# Altium project LPC55S69.PrjPcb
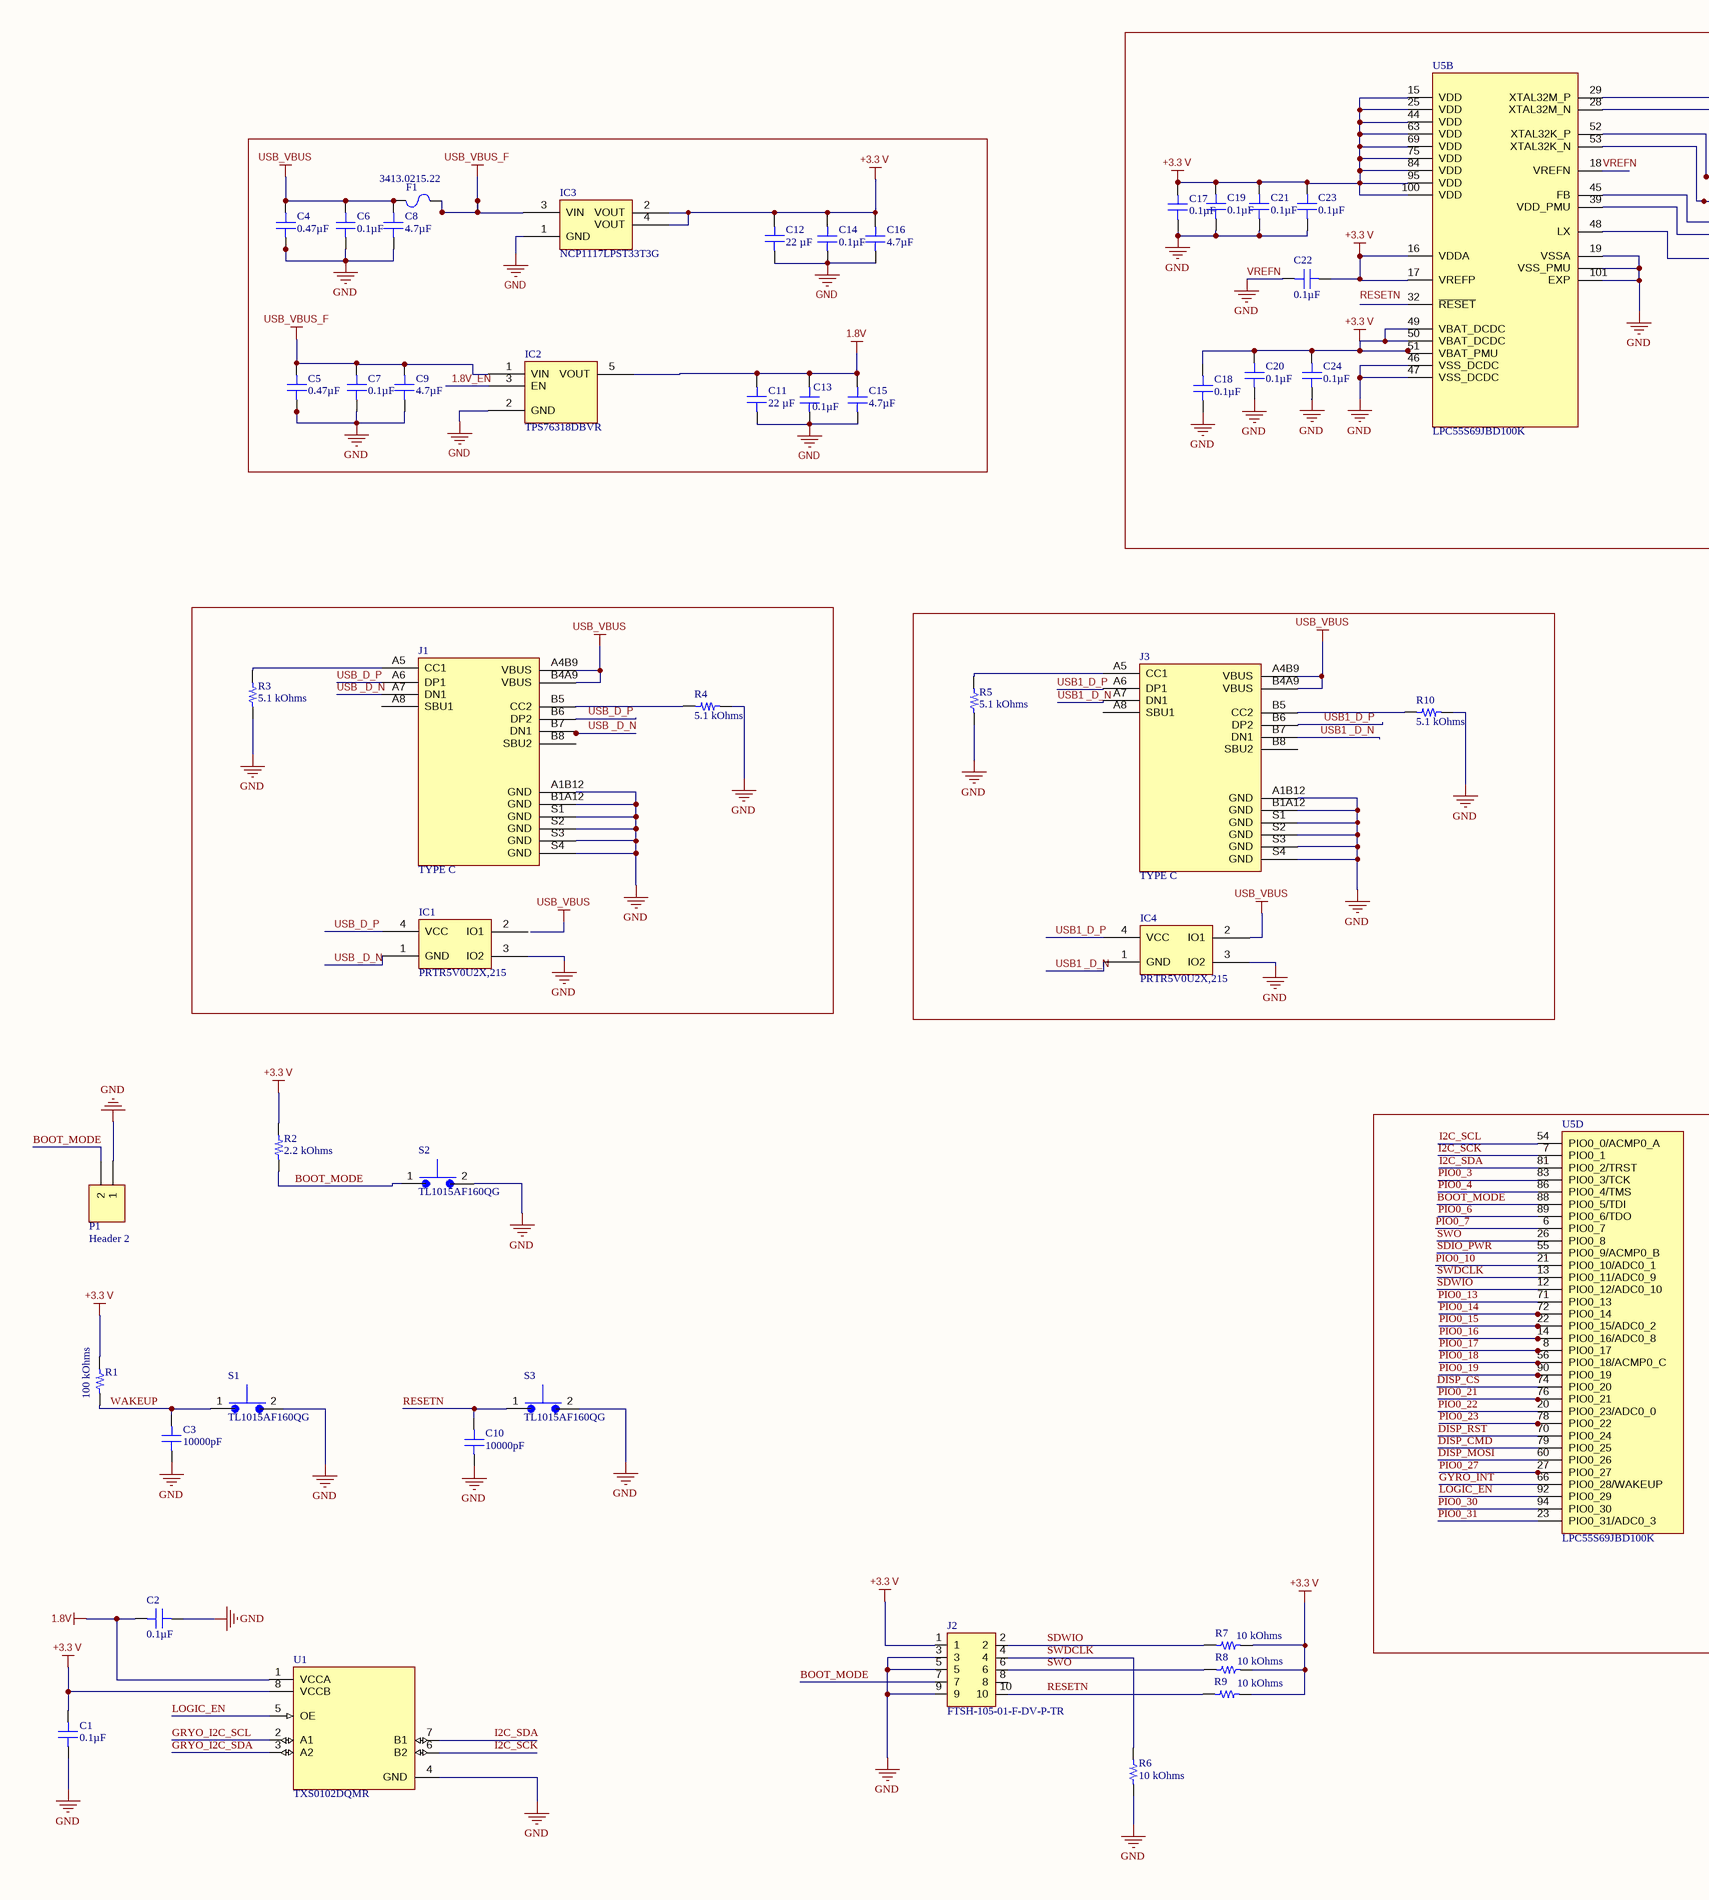
[diagram p0: Sheet1.SchDoc, left]
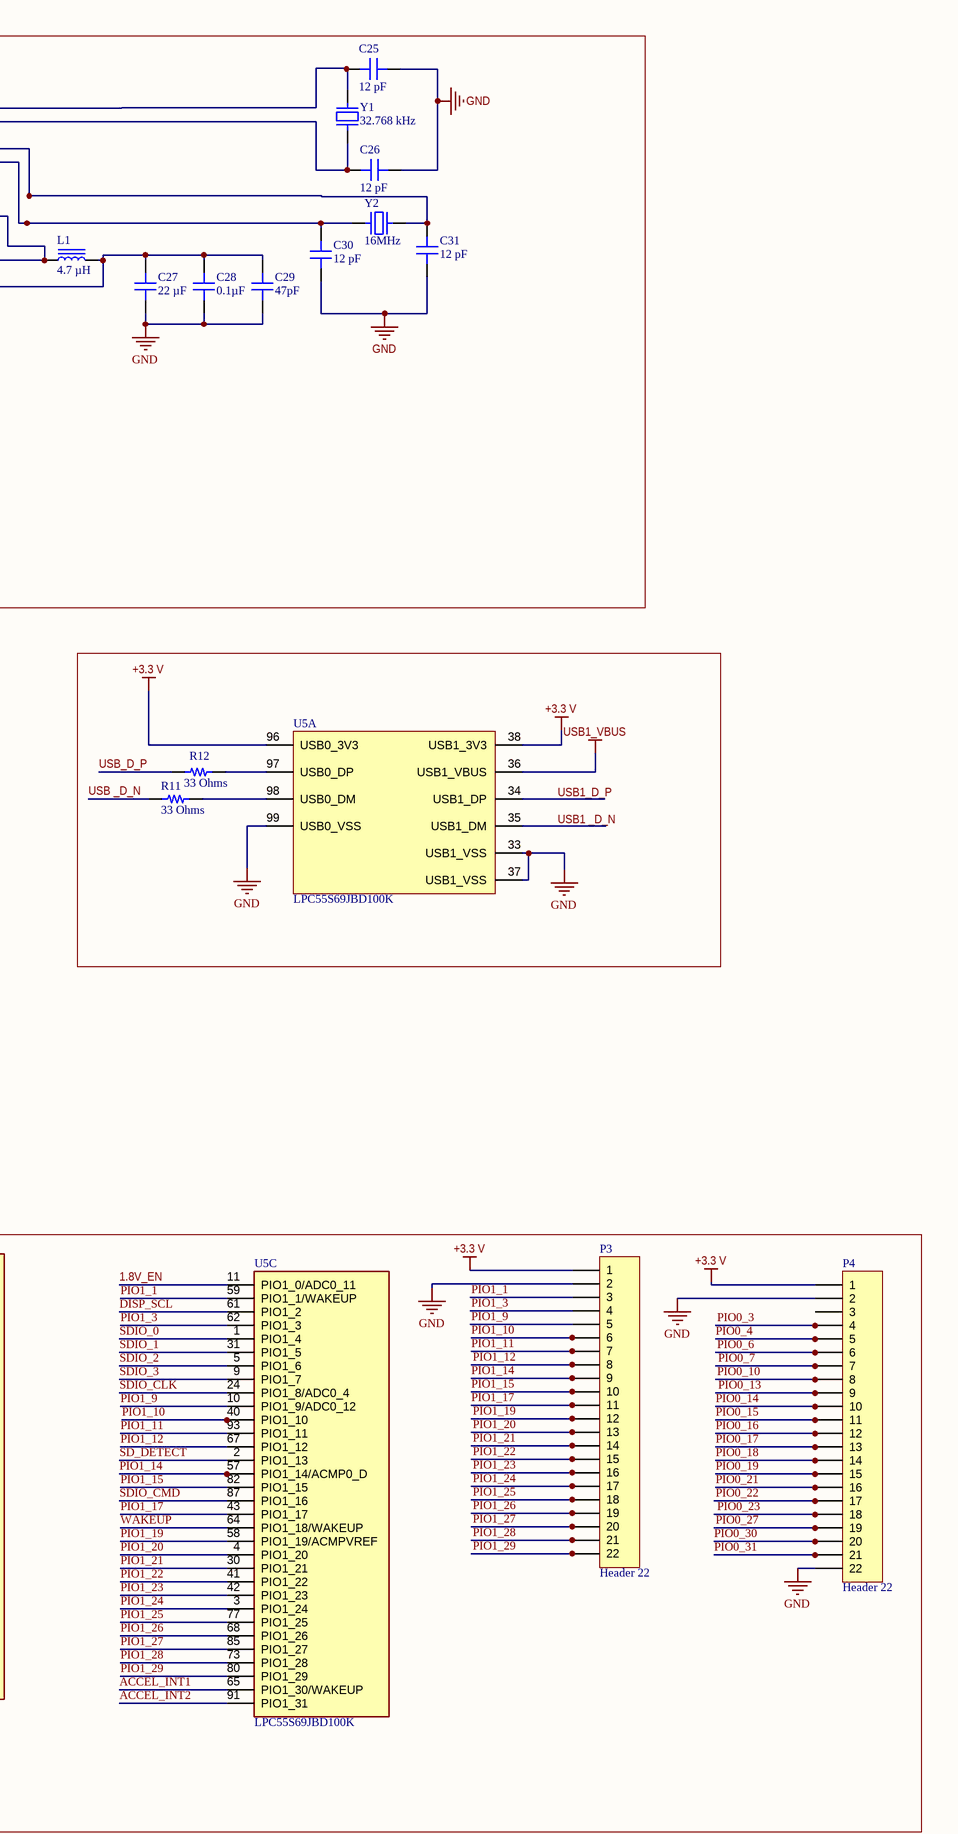
[diagram p1: Sheet1.SchDoc, right]
2 sheets, 116 parts. Net scope: global (net labels, ports and power ports of the same name join across sheets).
Board file: DEV.PcbDoc
Sheets:
  Sheet1.SchDoc
  Sheet2.SchDoc

## Sheet Sheet1.SchDoc
size 558 x 431 mm; Engineer: Mahmut Akçakoca; SheetNumber: 1; SheetTotal: 2

### Parts
C1  0.1µF  [CAP 0603_1608]
C2  0.1µF  [CAP 0603_1608]
C3  10000pF  [CAP 0603_1608]
C4  0.47µF  [CAP 0603_1608]
C5  0.47µF  [CAP 0603_1608]
C6  0.1µF  [CAP 0603_1608]
C7  0.1µF  [CAP 0603_1608]
C8  4.7µF  [CAP 0603_1608]
C9  4.7µF  [CAP 0603_1608]
C10  10000pF  [CAP 0603_1608]
C11  22 µF  [CAP 0603_1608]
C12  22 µF  [CAP 0603_1608]
C13  0.1µF  [CAP 0603_1608]
C14  0.1µF  [CAP 0603_1608]
C15  4.7µF  [CAP 0603_1608]
C16  4.7µF  [CAP 0603_1608]
C17  0.1µF  [CAP 0603_1608]
C18  0.1µF  [CAP 0603_1608]
C19  0.1µF  [CAP 0603_1608]
C20  0.1µF  [CAP 0603_1608]
C21  0.1µF  [CAP 0603_1608]
C22  0.1µF  [CAP 0603_1608]
C23  0.1µF  [CAP 0603_1608]
C24  0.1µF  [CAP 0603_1608]
C25  12 pF  [CAP 0603_1608]
C26  12 pF  [CAP 0603_1608]
C27  22 µF  [CAP 0603_1608]
C28  0.1µF  [CAP 0603_1608]
C29  47pF  [CAP 0603_1608]
C30  12 pF  [CAP 0603_1608]
C31  12 pF  [CAP 0603_1608]
F1  3413.0215.22  [FUSE 1206_3216 0.6MM]
IC1  PRTR5V0U2X,215  [SOT143B]
IC2  TPS76318DBVR  [TI SOT-23-5 DBV]
IC3  NCP1117LPST33T3G  [ON SEMI SOT-223 ST(318H)]
IC4  PRTR5V0U2X,215  [SOT143B]
J1  TYPE C  [HRO_TYPE-C-31-M-12]
J2  FTSH-105-01-F-DV-P-TR  [SAMTEC_FTSH-105-01-F-DV-P-TR]
J3  TYPE C  [HRO_TYPE-C-31-M-12]
L1  4.7 µH  [TDK VLS252012CX]
P1  Header 2  [HDR1X2]
P3  Header 22  [HDR1X22]
P4  Header 22  [HDR1X22]
R1  100 kOhms  [RES 0603_1608]
R2  2.2 kOhms  [RES 0603_1608]
R3  5.1 kOhms  [RES 0603_1608]
R4  5.1 kOhms  [RES 0603_1608]
R5  5.1 kOhms  [RES 0603_1608]
R6  10 kOhms  [RES 0603_1608]
R7  10 kOhms  [RES 0603_1608]
R8  10 kOhms  [RES 0603_1608]
R9  10 kOhms  [RES 0603_1608]
R10  5.1 kOhms  [RES 0603_1608]
R11  33 Ohms  [RES 0603_1608]
R12  33 Ohms  [RES 0603_1608]
S1  TL1015AF160QG  [SW_TL1015AF160QG]
S2  TL1015AF160QG  [SW_TL1015AF160QG]
S3  TL1015AF160QG  [SW_TL1015AF160QG]
U1  TXS0102DQMR  [IC_TXS0102DQMR]
U5  LPC55S69JBD100K  [QFP50P1600X1600X160-101N]  (parts A,B,C,D of 4)
Y1  32.768 kHz  [ABRACON ABS06]
Y2  16MHz  [KYOCERA CX3225GB]

### Nets
1.8V: C2.2 C11.1 C13.2 C15.2 IC2.5(VOUT) U1.1(VCCA)
+3.3 V: C1.2 C12.1 C14.2 C16.2 C17.1 C18.2 C19.1 C20.2 C21.1 C22.2 C23.1 C24.2 IC3.2(VOUT) IC3.4(VOUT) J2.1 P3.1 P4.1 R1.2 R2.2 R7.2 R8.2 R9.2 U1.8(VCCB) U5.15(VDD) U5.16(VDDA) U5.17(VREFP) U5.25(VDD) U5.38(USB1_3V3) U5.44(VDD) U5.49(VBAT_DCDC) U5.50(VBAT_DCDC) U5.51(VBAT_PMU) U5.63(VDD) U5.69(VDD) U5.75(VDD) U5.84(VDD) U5.95(VDD) U5.96(USB0_3V3) U5.100(VDD)  [project net VDD]
GND: C1.1 C2.1 C3.1 C4.1 C5.1 C6.1 C7.1 C8.1 C9.1 C10.1 C11.2 C12.2 C13.1 C14.1 C15.1 C16.1 C17.2 C18.1 C19.2 C20.1 C21.2 C22.1 C23.2 C24.1 C25.2 C26.2 C27.2 C28.1 C29.1 C30.2 C31.2 IC1.3(IO2) IC2.2(GND) IC3.1(GND) IC4.3(IO2) J1.A1B12(GND) J1.B1A12(GND) J1.S1(GND) J1.S2(GND) J1.S3(GND) J1.S4(GND) J2.3 J2.5 J2.9 J3.A1B12(GND) J3.B1A12(GND) J3.S1(GND) J3.S2(GND) J3.S3(GND) J3.S4(GND) P1.1 P3.2 P4.2 P4.22 R3.1 R4.2 R5.1 R6.1 R10.2 S1.2 S2.2 S3.2 U1.4(GND) U5.18(VREFN) U5.19(VSSA) U5.33(USB1_VSS) U5.37(USB1_VSS) U5.46(VSS_DCDC) U5.47(VSS_DCDC) U5.99(USB0_VSS) U5.101(EXP) U5.?1(VSS_PMU)  [also labelled VREFN]
USB1_VBUS: U5.36(USB1_VBUS)
USB_VBUS: C4.2 C6.2 C8.2 F1.1 IC4.2(IO1) J1.A4B9(VBUS) J1.B4A9(VBUS) J3.A4B9(VBUS) J3.B4A9(VBUS)
USB_VBUS_F: C5.2 C7.2 C9.2 F1.2 IC2.1(VIN) IC3.3(VIN)
1.8V_EN: IC2.3(EN) U5.11(PIO1_0/ADC0_11)
ACCEL_INT1: U5.65(PIO1_30/WAKEUP)
ACCEL_INT2: U5.91(PIO1_31)
BOOT_MODE: J2.7 P1.2 R2.1 S2.1 U5.88(PIO0_5/TDI)
DISP_CMD: U5.79(PIO0_25)
DISP_CS: U5.74(PIO0_20)
DISP_MOSI: U5.60(PIO0_26)
DISP_RST: U5.70(PIO0_24)
DISP_SCL: U5.61(PIO1_2)
GRYO_I2C_SCL: U1.2(A1)
GRYO_I2C_SDA: U1.3(A2)
GYRO_INT: U5.66(PIO0_28/WAKEUP)
I2C_SCK: U1.6(B2) U5.7(PIO0_1)
I2C_SCL: U5.54(PIO0_0/ACMP0_A)
I2C_SDA: U1.7(B1) U5.81(PIO0_2/TRST)
LOGIC_EN: U1.5(OE) U5.92(PIO0_29)
PIO0_3: P4.4 U5.83(PIO0_3/TCK)
PIO0_4: P4.5 U5.86(PIO0_4/TMS)
PIO0_6: P4.6 U5.89(PIO0_6/TDO)
PIO0_7: P4.7 U5.6(PIO0_7)
PIO0_10: P4.8 U5.21(PIO0_10/ADC0_1)
PIO0_13: P4.9 U5.71(PIO0_13)
PIO0_14: P4.10 U5.72(PIO0_14)
PIO0_15: P4.11 U5.22(PIO0_15/ADC0_2)
PIO0_16: P4.12 U5.14(PIO0_16/ADC0_8)
PIO0_17: P4.13 U5.8(PIO0_17)
PIO0_18: P4.14 U5.56(PIO0_18/ACMP0_C)
PIO0_19: P4.15 U5.90(PIO0_19)
PIO0_21: P4.16 U5.76(PIO0_21)
PIO0_22: P4.17 U5.20(PIO0_23/ADC0_0)
PIO0_23: P4.18 U5.78(PIO0_22)
PIO0_27: P4.19 U5.27(PIO0_27)
PIO0_30: P4.20 U5.94(PIO0_30)
PIO0_31: P4.21 U5.23(PIO0_31/ADC0_3)
PIO1_1: P3.3 U5.59(PIO1_1/WAKEUP)
PIO1_3: P3.4 U5.62(PIO1_3)
PIO1_9: P3.5 U5.10(PIO1_9/ADC0_12)
PIO1_10: P3.6 U5.40(PIO1_10)
PIO1_11: P3.7 U5.93(PIO1_11)
PIO1_12: P3.8 U5.67(PIO1_12)
PIO1_14: P3.9 U5.57(PIO1_14/ACMP0_D)
PIO1_15: P3.10 U5.82(PIO1_15)
PIO1_17: P3.11 U5.43(PIO1_17)
PIO1_19: P3.12 U5.58(PIO1_19/ACMPVREF)
PIO1_20: P3.13 U5.4(PIO1_20)
PIO1_21: P3.14 U5.30(PIO1_21)
PIO1_22: P3.15 U5.41(PIO1_22)
PIO1_23: P3.16 U5.42(PIO1_23)
PIO1_24: P3.17 U5.3(PIO1_24)
PIO1_25: P3.18 U5.77(PIO1_25)
PIO1_26: P3.19 U5.68(PIO1_26)
PIO1_27: P3.20 U5.85(PIO1_27)
PIO1_28: P3.21 U5.73(PIO1_28)
PIO1_29: P3.22 U5.80(PIO1_29)
RESETN: C10.2 J2.10 R9.1 S3.1
SD_DETECT: U5.2(PIO1_13)
SDIO_0: U5.1(PIO1_4)
SDIO_1: U5.31(PIO1_5)
SDIO_2: U5.5(PIO1_6)
SDIO_3: U5.9(PIO1_7)
SDIO_CLK: U5.24(PIO1_8/ADC0_4)
SDIO_CMD: U5.87(PIO1_16)
SDIO_PWR: U5.55(PIO0_9/ACMP0_B)
SDWIO: J2.2 R7.1 U5.12(PIO0_12/ADC0_10)
SWDCLK: J2.4 R6.2 U5.13(PIO0_11/ADC0_9)
SWO: J2.6 R8.1 U5.26(PIO0_8)
USB1 _D_N: IC4.1(GND) J3.A7(DN1) J3.B7(DN1)
USB1_D_P: IC4.4(VCC) J3.A6(DP1) J3.B6(DP2)
USB _D_N: IC1.1(GND) J1.A7(DN1) J1.B7(DN1) R11.1
USB_D_P: IC1.4(VCC) J1.A6(DP1) J1.B6(DP2) R12.1
WAKEUP: C3.2 R1.1 S1.1 U5.64(PIO1_18/WAKEUP)
NetC25_1: C25.1 U5.29(XTAL32M_P) Y1.2
NetC26_1: C26.1 U5.28(XTAL32M_N) Y1.1
NetC27_1: C27.1 C28.2 C29.2 L1.2 U5.48(LX)
NetC30_1: C30.1 U5.53(XTAL32K_N) Y2.1
NetC31_1: C31.1 U5.52(XTAL32K_P) Y2.3
NetJ1_A5: J1.A5(CC1) R3.2
NetJ1_B5: J1.B5(CC2) R4.1
NetJ3_A5: J3.A5(CC1) R5.2
NetJ3_B5: J3.B5(CC2) R10.1
NetL1_1: L1.1 U5.39(VDD_PMU) U5.45(FB)
NetR11_2: R11.2 U5.98(USB0_DM)
NetR12_2: R12.2 U5.97(USB0_DP)

Not connected (* = marked no-connect by the designer): IC1 2(IO1); J1 A8(SBU1) B8(SBU2); J2 8; J3 A8(SBU1) B8(SBU2); P4 3; U5 32(~{RESET}) 34(USB1_DP) 35(USB1_DM)

### Notes on the sheet
- Labels drawn without touching a wire or pin: RESETN, USB1 _D_N, USB1_D_P
- DWG. NO.
- REV.
- SHT.
- REVISION
- DESCRIPTION
- DATE
- APPROVED
- THIS DOCUMENT AND THE DATA DISCLOSED HEREIN OR HEREWITH IS THE PROPERTY OF ALTIUM LIMITED AND MAY BE FREELY DISTRIBUTED IN WHOLE. NO RIGHTS ARE RESERVED OR EXPRESS OR IMPLIED WARANTEE GIVEN.
- ENG:
- DSN:
- APPROVALS
- PROJECT
- DOCUMENT REVISION:
- DESIGN ITEM:
- CHK:
- BOM:
- REFERENCE DOCUMENTS
- PROJECT REVISION:
- TITLE
- FAB DWG:
- PCB DWG:
- ASSY DWG:
- SCALE:
- SIZE
- C
- CAGE CODE
- FILE NAME
- DWG NO.
- SHEET
- OF
- REV

### Library data of the parts
C1 C2 C6 C7 C13 C14 C17-C24 C28 = 0603YD104KAT2A: CAP CER 0.1UF 16V X5R 0603; manufacturer: AVX Corporation; Tolerance: ±10%; Part Number: 0603YD104KAT2A; Value: 0.1µF; Applications: General Purpose; Capacitance: 0.1µF; componentlink1description: Datasheet; componentlink1url: http://datasheets.avx.com/cx5r.pdf; componentlink2description: DigiKey Link; componentlink2url: http://digikey.com/product-detail/en/avx-corporation/0603YD104KAT2A/478-0603YD104KAT2ACT-ND/11570385; Device Package: 0603 (1608 Metric); lastupdated: 2.09.2020 01:02:55; Lifecycle Status: Active; Minimum Order: 1; Mounting Type: Surface Mount, MLCC; Operating Temperature: -55°C ~ 85°C; Package / Case: 0603 (1608 Metric); packaging: TapeAndReel; partid: 27394; Part Status: Active; price: 0.05; series: -; Supplier 1: DigiKey; Supplier Part Number 1: 478-0603YD104KAT2ACT-ND; Temperature Coefficient: X5R; Voltage - Rated: 16V
C3 C10 = 06033D103KAT2A: CAP CER 10000PF 25V X5R 0603; Part Number: 06033D103KAT2A
C4 C5 = 0603ZD474KAT2A: CAP CER 0.47UF 10V X5R 0603; manufacturer: AVX Corporation; Tolerance: ±10%; Part Number: 0603ZD474KAT2A; Value: 0.47µF; Applications: General Purpose; Capacitance: 0.47µF; componentlink1description: Datasheet; componentlink1url: http://datasheets.avx.com/cx5r.pdf; componentlink2description: DigiKey Link; componentlink2url: http://digikey.com/product-detail/en/avx-corporation/0603ZD474KAT2A/478-7942-1-ND/3881565; Device Package: 0603 (1608 Metric); lastupdated: 2.09.2020 01:03:34; Lifecycle Status: Active; Minimum Order: 1; Mounting Type: Surface Mount, MLCC; Operating Temperature: -55°C ~ 85°C; Package / Case: 0603 (1608 Metric); packaging: TapeAndReel; partid: 3385; Part Status: Active; price: 0.10; series: -; Size / Dimension: 0.063" L x 0.032" W (1.60mm x 0.81mm); Supplier 1: DigiKey; Supplier Part Number 1: 478-7942-1-ND; Temperature Coefficient: X5R; Thickness (Max): 0.035" (0.90mm); Voltage - Rated: 10V
C8 C9 C15 C16 = 0603ZD475KAT2A: CAP CER 4.7UF 10V X5R 0603; manufacturer: AVX Corporation; Tolerance: ±10%; Part Number: 0603ZD475KAT2A; Value: 4.7µF; Applications: General Purpose; Capacitance: 4.7µF; componentlink1description: Datasheet; componentlink1url: http://datasheets.avx.com/cx5r.pdf; componentlink2description: DigiKey Link; componentlink2url: http://digikey.com/product-detail/en/avx-corporation/0603ZD475KAT2A/478-7943-1-ND/3881566; Device Package: 0603 (1608 Metric); lastupdated: 2.09.2020 01:02:59; Lifecycle Status: Active; Minimum Order: 1; Mounting Type: Surface Mount, MLCC; Operating Temperature: -55°C ~ 85°C; Package / Case: 0603 (1608 Metric); partid: 18469; Part Status: Active; price: 0; series: -; Size / Dimension: 0.063" L x 0.032" W (1.60mm x 0.81mm); Supplier 1: DigiKey; Supplier Part Number 1: 478-7943-1-ND; Temperature Coefficient: X5R; Thickness (Max): 0.035" (0.90mm); Voltage - Rated: 10V
C11 C12 C27 = CL10A226MQ8NRNC: CAP CER 22UF 6.3V X5R 0603; manufacturer: Samsung Electro-Mechanics; Tolerance: ±20%; Part Number: CL10A226MQ8NRNC; Value: 22 µF; Applications: General Purpose; Capacitance: 22 µF; componentlink1description: Datasheet; componentlink1url: http://www.samsungsem.com/kr/support/product-search/mlcc/CL10A226MQ8NRNC.jsp; componentlink2description: DigiKey Link; componentlink2url: https://www.digikey.com/en/products/detail/samsung-electro-mechanics/CL10A226MQ8NRNC/3886851; Device Package: 0603 (1608 Metric); lastupdated: 14.08.2022 21:09:18; Lifecycle Status: Active; Minimum Order: 1; Mounting Type: Surface Mount, MLCC; Operating Temperature: -55°C ~ 85°C; Package / Case: 0603 (1608 Metric); packaging: TapeAndReel; partid: 12892; Part Status: Active; price: 0.03; series: CL; Size / Dimension: 0.063" L x 0.031" W (1.60mm x 0.80mm); Supplier 1: DigiKey; Supplier Part Number 1: 1276-1193-1-ND; Temperature Coefficient: X5R; Thickness (Max): 0.039" (1.00mm); Voltage - Rated: 6.3V
C25 C26 C30 C31 = C0603C120J3GACAUTO: CAP CER 12PF 25V C0G/NP0 0603; manufacturer: KEMET; Temperature Coefficient: C0G, NP0; Tolerance: ±5%; Part Number: C0603C120J3GACAUTO; Value: 12 pF; Applications: Automotive; Capacitance: 12 pF; componentlink1description: Datasheet; componentlink1url: https://api.kemet.com/component-edge/download/datasheet/C0603C120J3GACAUTO.pdf; componentlink2description: DigiKey Link; componentlink2url: https://www.digikey.com/en/products/detail/kemet/C0603C120J3GACAUTO/11675595; Device Package: 0603 (1608 Metric); Features: Low ESL; lastupdated: 14.08.2022 21:08:38; Lifecycle Status: Active; Minimum Order: 1; Mounting Type: Surface Mount, MLCC; Operating Temperature: -55°C ~ 125°C; Package / Case: 0603 (1608 Metric); packaging: TapeAndReel; partid: 35212; Part Status: Active; price: 0.04; Ratings: AEC-Q200; series: SMD Auto C0G; Size / Dimension: 0.063" L x 0.031" W (1.60mm x 0.80mm); Supplier 1: DigiKey; Supplier Part Number 1: 399-C0603C120J3GACAUTOCT-ND; Thickness (Max): 0.034" (0.87mm); Voltage - Rated: 25V
C29 = 06033A470KAT2A: CAP CER 47PF 25V C0G/NP0 0603; manufacturer: AVX Corporation; Temperature Coefficient: C0G, NP0; Tolerance: ±10%; Part Number: 06033A470KAT2A; Value: 47pF; Applications: General Purpose; Capacitance: 47pF; componentlink1description: Datasheet; componentlink1url: http://datasheets.avx.com/C0GNP0-Dielectric.pdf; componentlink2description: DigiKey Link; componentlink2url: http://digikey.com/product-detail/en/avx-corporation/06033A470KAT2A/478-06033A470KAT2ACT-ND/11570258; Device Package: 0603 (1608 Metric); lastupdated: 2.09.2020 01:02:55; Lifecycle Status: Active; Minimum Order: 1; Mounting Type: Surface Mount, MLCC; Operating Temperature: -55°C ~ 125°C; Package / Case: 0603 (1608 Metric); packaging: TapeAndReel; partid: 27418; Part Status: Active; price: 0.04; series: -; Supplier 1: DigiKey; Supplier Part Number 1: 478-06033A470KAT2ACT-ND; Voltage - Rated: 25V
F1 = 3413.0215.22: FUSE BOARD MNT 800MA 32VAC 63VDC; Manufacturer: Schurter Inc.; Approval Agency: cURus, VDE; Breaking Capacity @ Rated Voltage: 63A; Fuse Type: Board Mount (Cartridge Style Excluded); Melting I²t: 0.18; Response Time: Fast Blow; Voltage Rating - AC: 32V; Voltage Rating - DC: 63V; Part Number: 3413.0215.22; Approvals: cURus, VDE; ComponentLink1Description: Datasheet; ComponentLink1URL: https://us.schurter.com/pdf/english/typ_USI_1206.pdf; ComponentLink2Description: DigiKey Link; ComponentLink2URL: http://digikey.com/product-detail/en/schurter-inc/3413.0215.22/486-1143-1-ND/1522975; Current Rating (Amps): 800mA; Device Package: 1206 (3216 Metric); LastUpdated: 2.09.2020 01:30:41; Lifecycle Status: Active; Minimum Order: 1; Mounting Type: Surface Mount; Operating Temperature: -55°C ~ 90°C; Package / Case: 1206 (3216 Metric); Packaging: TapeAndReel; Part Status: Active; Price: 0.26; Series: USI 1206; Size / Dimension: 0.126" L x 0.063" W x 0.024" H (3.20mm x 1.60mm x 0.60mm); Supplier 1: DigiKey; Supplier Part Number 1: 486-1143-1-ND
IC1 IC4 = PRTR5V0U2X,215: TVS DIODE 5.5V SOT143B; Manufacturer: Nexperia USA Inc.; Capacitance @ Frequency: 1pF @ 1MHz; Power Line Protection: Yes; Unidirectional Channels: 2; Voltage - Breakdown (Min): 6V; Voltage - Reverse Standoff (Typ): 5.5V (Max); Part Number: PRTR5V0U2X,215; Applications: General Purpose; ComponentLink1Description: Datasheet; ComponentLink1URL: https://assets.nexperia.com/documents/data-sheet/PRTR5V0U2X.pdf; ComponentLink2Description: DigiKey Link; ComponentLink2URL: //digikey.com/product-detail/en/nexperia-usa-inc/PRTR5V0U2X215/1727-3884-2-ND/1163690; Device Package: TO-253-4, TO-253AA; LastUpdated: 9.12.2019 21:29:05; Lifecycle Status: 0; Minimum Order: 1; Mounting Type: Surface Mount; Operating Temperature: -40°C ~ 85°C (TA); Package / Case: TO-253-4, TO-253AA; Packaging: TapeAndReel; PartId: 5451; Part Status: Active; Price: 0.18; Series: -; Supplier 1: DigiKey; Supplier Part Number 1: 1727-3884-2-ND; Supplier Device Package: SOT-143B; Type: Steering (Rail to Rail)
IC2 = TPS76318DBVR: IC REG LINEAR 1.8V 150MA SOT23-5; Manufacturer: Texas Instruments; Control Features: Enable; Current - Quiescent (Iq): 100 µA; Current - Supply (Max): 140 µA; Number of Regulators: 1; Output Configuration: Positive; Output Type: Fixed; Protection Features: Over Current, Over Temperature, Reverse Polarity; PSRR: 60dB (1kHz); Voltage - Input (Max): 10V; Part Number: TPS76318DBVR; ComponentLink1Description: Datasheet; ComponentLink1URL: http://www.ti.com/general/docs/suppproductinfo.tsp?distId=10&gotoUrl=http%3A%2F%2Fwww.ti.com%2Flit%2Fgpn%2Ftps763; ComponentLink2Description: DigiKey Link; ComponentLink2URL: https://www.digikey.com/en/products/detail/texas-instruments/TPS76318DBVR/382161; Current - Output: 150mA; LastUpdated: 14.08.2022 22:05:47; Lifecycle Status: Active; Minimum Order: 1; Mounting Type: Surface Mount; Operating Temperature: -40°C ~ 125°C; Package / Case: SC-74A, SOT-753; Packaging: TapeAndReel; Part Status: Active; Price: 0.36; Series: -; Supplier 1: DigiKey; Supplier Part Number 1: 296-11016-1-ND; Supplier Device Package: SOT-23-5; Voltage - Output (Min/Fixed): 1.8V
IC3 = NCP1117LPST33T3G: IC REG LINEAR 3.3V 1A SOT223; Manufacturer: ON Semiconductor; Current - Quiescent (Iq): 700µA; Number of Regulators: 1; Output Configuration: Positive; Output Type: Fixed; Protection Features: Over Current, Over Temperature; PSRR: 60dB (120Hz); Voltage Dropout (Max): 1.4V @ 1A; Voltage - Input (Max): 18V; Part Number: NCP1117LPST33T3G; ComponentLink1Description: Datasheet; ComponentLink1URL: http://www.onsemi.com/pub/Collateral/NCP1117LP-D.PDF; ComponentLink2Description: DigiKey Link; ComponentLink2URL: http://digikey.com/product-detail/en/on-semiconductor/NCP1117LPST33T3G/NCP1117LPST33T3GOSCT-ND/3462387; Current - Output: 1A; LastUpdated: 14.08.2022 22:05:49; Lifecycle Status: Active; Minimum Order: 1; Mounting Type: Surface Mount; Package / Case: TO-261-4, TO-261AA; Packaging: TapeAndReel; Part Status: Active; Price: 0.12; Series: -; Supplier 1: DigiKey; Supplier Part Number 1: NCP1117LPST33T3GOSCT-ND; Supplier Device Package: SOT-223; Voltage - Output (Min/Fixed): 3.3V
J1 J3 = TYPE C: HIRO TYPE-C-31-M-12
J2 = FTSH-105-01-F-DV-P-TR: Connector Header Surface Mount 10 position 0.050 (1.27mm); MF: Samtec; Value: *; SnapEDA_Link: https://www.snapeda.com/parts/FTSH-105-01-F-DV-P-TR/Samtec%20Inc./view-part/2790357/?ref=snap; MP: FTSH-105-01-F-DV-P-TR; Purchase-URL: https://pricing.snapeda.com/search/part/FTSH-105-01-F-DV-P-TR/?ref=eda; Check_prices: https://www.snapeda.com/parts/FTSH-105-01-F-DV-P-TR/Samtec%20Inc./view-part/2790357/?ref=eda; Availability: Bad; Price: None; Package: None
L1 = VLS252012CX-4R7M-1: FIXED IND 4.7UH 1.24A 210MOHM SM; Manufacturer: TDK Corporation; Current - Saturation: 1.1A; DC Resistance (DCR): 210mOhm Max; Inductance Frequency - Test: 1 MHz; Material - Core: Ferrite; Shielding: Shielded; Tolerance: ±20%; Type: Drum Core, Wirewound; Part Number: VLS252012CX-4R7M-1; ComponentLink1Description: Datasheet; ComponentLink1URL: https://product.tdk.com/info/en/catalog/datasheets/inductor_commercial_power_vls252012cx-1_en.pdf?ref_disty=digikey; ComponentLink2Description: DigiKey Link; ComponentLink2URL: https://www.digikey.com/en/products/detail/tdk-corporation/VLS252012CX-4R7M-1/5169790; Current Rating (Amps): 1.24 A; Device Package: Nonstandard; Height - Seated (Max): 0.047" (1.20mm); Inductance: 4.7 µH; LastUpdated: 14.08.2022 21:59:15; Lifecycle Status: Active; Minimum Order: 1; Mounting Type: Surface Mount; Operating Temperature: -40°C ~ 105°C; Package / Case: Nonstandard; Packaging: TapeAndReel; PartId: 228; Part Status: Active; Price: 0.15; Series: VLS-CX-1; Size / Dimension: 0.098" L x 0.079" W (2.50mm x 2.00mm); Supplier 1: DigiKey; Supplier Part Number 1: 445-172985-1-ND; Supplier Device Package: 2520; Value: 4.7 µH
P1 = Header 2: Header, 2-Pin; LatestRevisionDate: 17-Jul-2002; LatestRevisionNote: Re-released for DXP Platform.; Publisher: Altium Limited
P3 P4 = Header 22: Header, 22-Pin; LatestRevisionDate: 17-Jul-2002; LatestRevisionNote: Re-released for DXP Platform.; Publisher: Altium Limited
R1 = CRCW0603100KJNEA: RES SMD 100K OHM 5% 1/10W 0603; Manufacturer: Vishay Dale; Power (Watts): 0.1W, 1/10W; Temperature Coefficient: ±200ppm/°C; Part Number: CRCW0603100KJNEA; Value: 100 kOhms; ComponentLink1Description: Datasheet; ComponentLink1URL: http://www.vishay.com/docs/20035/dcrcwe3.pdf; ComponentLink2Description: DigiKey Link; ComponentLink2URL: https://www.digikey.com/en/products/detail/vishay-dale/CRCW0603100KJNEA/1174277; Composition: Thick Film; Device Package: 0603 (1608 Metric); Features: Automotive AEC-Q200; Height - Seated (Max): 0.020" (0.50mm); LastUpdated: 14.08.2022 21:30:46; Lifecycle Status: Active; Minimum Order: 1; Number of Terminations: 2; Operating Temperature: -55°C ~ 155°C; Package / Case: 0603 (1608 Metric); Packaging: CutTape; PartId: 21189; Part Status: Active; Price: 0.01; Ratings: AEC-Q200; Resistance: 100 kOhms; Series: CRCW; Size / Dimension: 0.063" L x 0.033" W (1.60mm x 0.85mm); Supplier 1: DigiKey; Supplier Part Number 1: 541-100KGCT-ND; Supplier Device Package: 0603; Tolerance: ±5%
R2 = CRCW06032K20JNEA: RES SMD 2.2K OHM 5% 1/10W 0603; Part Number: CRCW06032K20JNEA
R3-R5 R10 = RMCF0603JG5K10: RES 5.1K OHM 5% 1/10W 0603; Manufacturer: Stackpole Electronics Inc; Power (Watts): 0.1W, 1/10W; Temperature Coefficient: ±200ppm/°C; Part Number: RMCF0603JG5K10; Value: 5.1 kOhms; ComponentLink1Description: Datasheet; ComponentLink1URL: https://www.seielect.com/catalog/sei-packaging.pdf; ComponentLink2Description: DigiKey Link; ComponentLink2URL: https://www.digikey.com/en/products/detail/stackpole-electronics-inc/RMCF0603JG5K10/1712287; Composition: Thick Film; Device Package: 0603 (1608 Metric); Features: Automotive AEC-Q200; Height - Seated (Max): 0.022" (0.55mm); LastUpdated: 14.08.2022 21:31:26; Lifecycle Status: Active; Minimum Order: 1; Number of Terminations: 2; Operating Temperature: -55°C ~ 155°C; Package / Case: 0603 (1608 Metric); Packaging: CutTape; PartId: 5180; Part Status: Active; Price: 0.01; Ratings: AEC-Q200; Resistance: 5.1 kOhms; Series: RMCF; Size / Dimension: 0.061" L x 0.031" W (1.55mm x 0.80mm); Supplier 1: DigiKey; Supplier Part Number 1: RMCF0603JG5K10CT-ND; Supplier Device Package: 0603; Tolerance: ±5%
R6-R9 = AC0603JR-0710KL: RES SMD 10K OHM 5% 1/10W 0603; Part Number: AC0603JR-0710KL; Value: 10 kOhms
R11 R12 = AC0603JR-0733RL: RES SMD 33 OHM 5% 1/10W 0603; Manufacturer: Yageo; Power (Watts): 0.1W, 1/10W; Temperature Coefficient: ±100ppm/°C; Part Number: AC0603JR-0733RL; Value: 33 Ohms; ComponentLink1Description: Datasheet; ComponentLink1URL: https://www.yageo.com/upload/media/product/productsearch/datasheet/rchip/PYu-AC_51_RoHS_L_7.pdf; ComponentLink2Description: DigiKey Link; ComponentLink2URL: https://www.digikey.com/en/products/detail/yageo/AC0603JR-0733RL/5896437; Composition: Thick Film; Device Package: 0603 (1608 Metric); Features: Automotive AEC-Q200, Moisture Resistant; Height - Seated (Max): 0.022" (0.55mm); LastUpdated: 14.08.2022 21:30:39; Lifecycle Status: Active; Minimum Order: 1; Number of Terminations: 2; Operating Temperature: -55°C ~ 155°C; Package / Case: 0603 (1608 Metric); Packaging: CutTape; PartId: 22917; Part Status: Active; Price: 0.01; Ratings: AEC-Q200; Resistance: 33 Ohms; Series: AC; Size / Dimension: 0.063" L x 0.031" W (1.60mm x 0.80mm); Supplier 1: DigiKey; Supplier Part Number 1: YAG3666CT-ND; Supplier Device Package: 0603; Tolerance: ±5%
S1-S3 = TL1015AF160QG: Tactile Switch SPST-NO Top Actuated Surface Mount; Package: None; Availability: Unavailable; Value: *; MP: TL1015AF160QG; Price: None
U5 = LPC55S69JBD100K: ARMÂ® CortexÂ®-M33 LPC55S6x Microcontroller IC 32-Bit 100MHz 640KB (640K x 8) FLASH 100-HLQFP (14x14); MF: NXP USA; SnapEDA_Link: https://www.snapeda.com/parts/LPC55S69JBD100K/NXP%20USA%20Inc./view-part/3218883/?ref=snap; Value: *; MP: LPC55S69JBD100K; Package: LQFP-100 NXP Semiconductors; DigiKey-Purchase-URL: https://snapeda.com/shop?store=DigiKey&id=3218883; Digi-Key_Part_Number: 568-15313-ND; Mouser-Purchase-URL: https://snapeda.com/shop?store=Mouser&id=3218883
Y1 = ABS06-32.768KHZ-9-1-T: CRYSTAL 32.7680KHZ 9PF SMD; Manufacturer: Abracon LLC; ESR (Equivalent Series Resistance): 90 kOhms; Frequency Tolerance: ±10ppm; Operating Mode: Fundamental; Part Number: ABS06-32.768KHZ-9-1-T; ComponentLink1Description: Datasheet; ComponentLink1URL: https://abracon.com/Resonators/ABS06.pdf; ComponentLink2Description: DigiKey Link; ComponentLink2URL: https://www.digikey.com/en/products/detail/abracon-llc/ABS06-32-768KHZ-9-1-T/2217993; Frequency: 32.768 kHz; Height - Seated (Max): 0.024" (0.60mm); LastUpdated: 14.08.2022 21:58:33; Lifecycle Status: Active; Load Capacitance: 9pF; Minimum Order: 1; Mounting Type: Surface Mount; Operating Temperature: -40°C ~ 85°C; Package / Case: 2-SMD, No Lead; Packaging: TapeAndReel; PartId: 371; Part Status: Active; Price: 1.11; Series: ABS06; Size / Dimension: 0.079" L x 0.047" W (2.00mm x 1.20mm); Supplier 1: DigiKey; Supplier Part Number 1: 535-10247-1-ND; Type: kHz Crystal (Tuning Fork); Value: 32.768 kHz
Y2 = CX3225GB16000D0HEQCC: CRYSTAL 16.0000MHZ 8PF SMD; Manufacturer: Kyocera International Inc. Electronic Components; ESR (Equivalent Series Resistance): 80 Ohms; Frequency Stability: ±30ppm; Frequency Tolerance: ±20ppm; Operating Mode: Fundamental; Part Number: CX3225GB16000D0HEQCC; ComponentLink1Description: Datasheet; ComponentLink1URL: //media.digikey.com/pdf/Data%20Sheets/AVX%20PDFs/CX3225GBxD0HEQ_Series_Spec.pdf; ComponentLink2Description: DigiKey Link; ComponentLink2URL: http://digikey.com/product-detail/en/kyocera-international-inc-electronic-components/CX3225GB16000D0HEQCC/1253-1180-1-ND/4453986; Frequency: 16MHz; Height - Seated (Max): 0.035" (0.90mm); LastUpdated: 14.08.2022 21:58:46; Lifecycle Status: Active; Load Capacitance: 8pF; Minimum Order: 1; Mounting Type: Surface Mount; Operating Temperature: -10°C ~ 70°C; Package / Case: 4-SMD, No Lead; Packaging: TapeAndReel; PartId: 485; Part Status: Active; Price: 0.33; Series: CX3225GB, Kyocera; Size / Dimension: 0.126" L x 0.098" W (3.20mm x 2.50mm); Supplier 1: DigiKey; Supplier Part Number 1: 1253-1180-1-ND; Type: MHz Crystal; Value: 16MHz
U1 = TXS0102DQMR: Package: None; Value: *; MP: TXS0102DQMR; Availability: Unavailable; Price: None

## Sheet Sheet2.SchDoc
size 558 x 431 mm; SheetNumber: 2; SheetTotal: 2
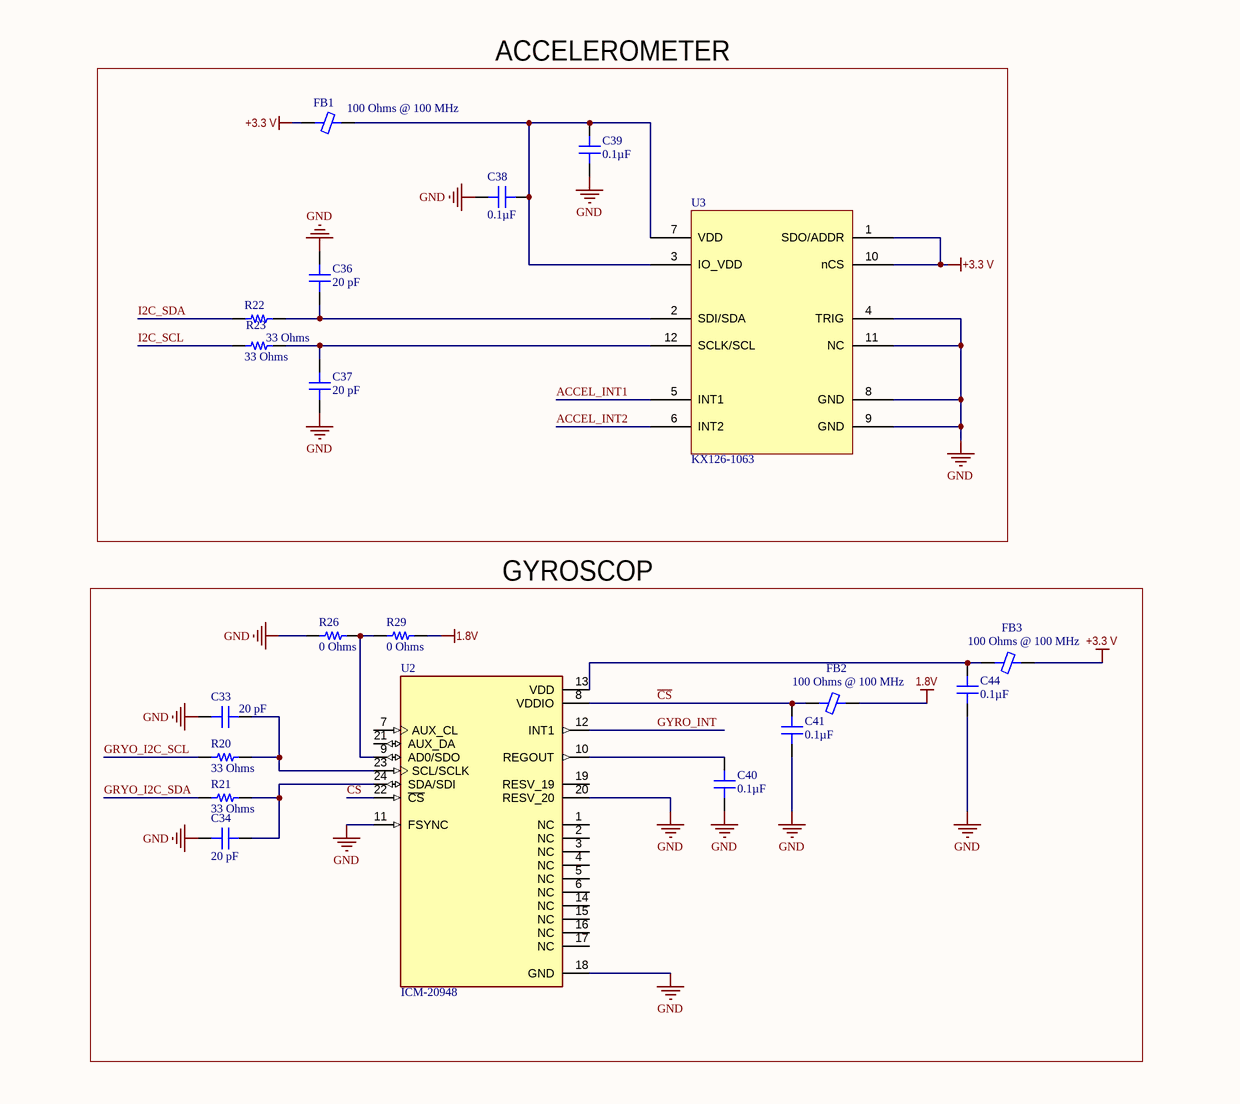
[diagram p2: Sheet2.SchDoc, top left]
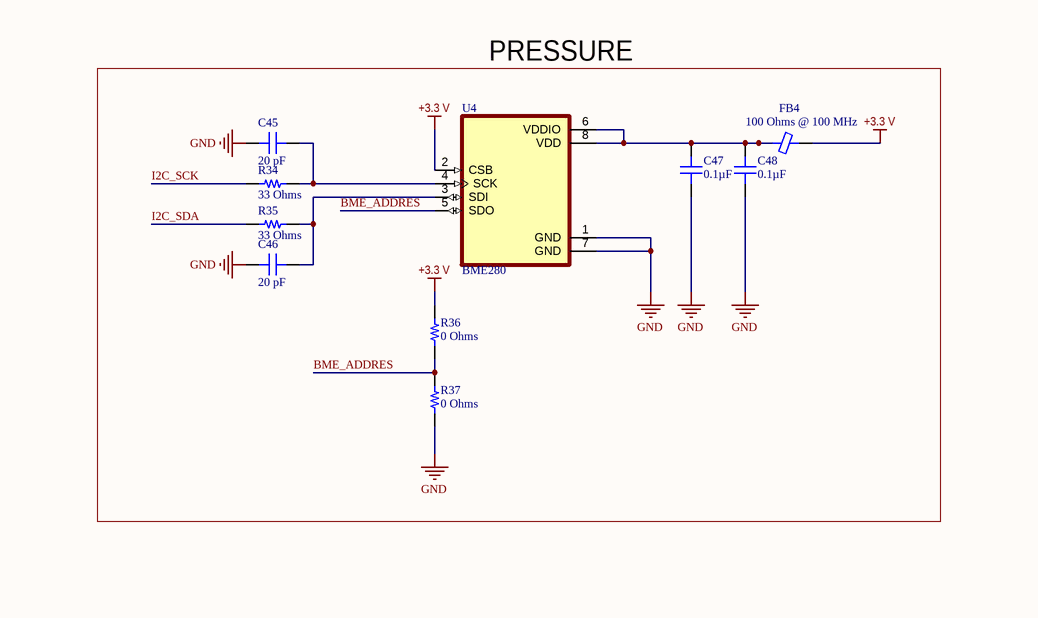
[diagram p3: Sheet2.SchDoc, top right]
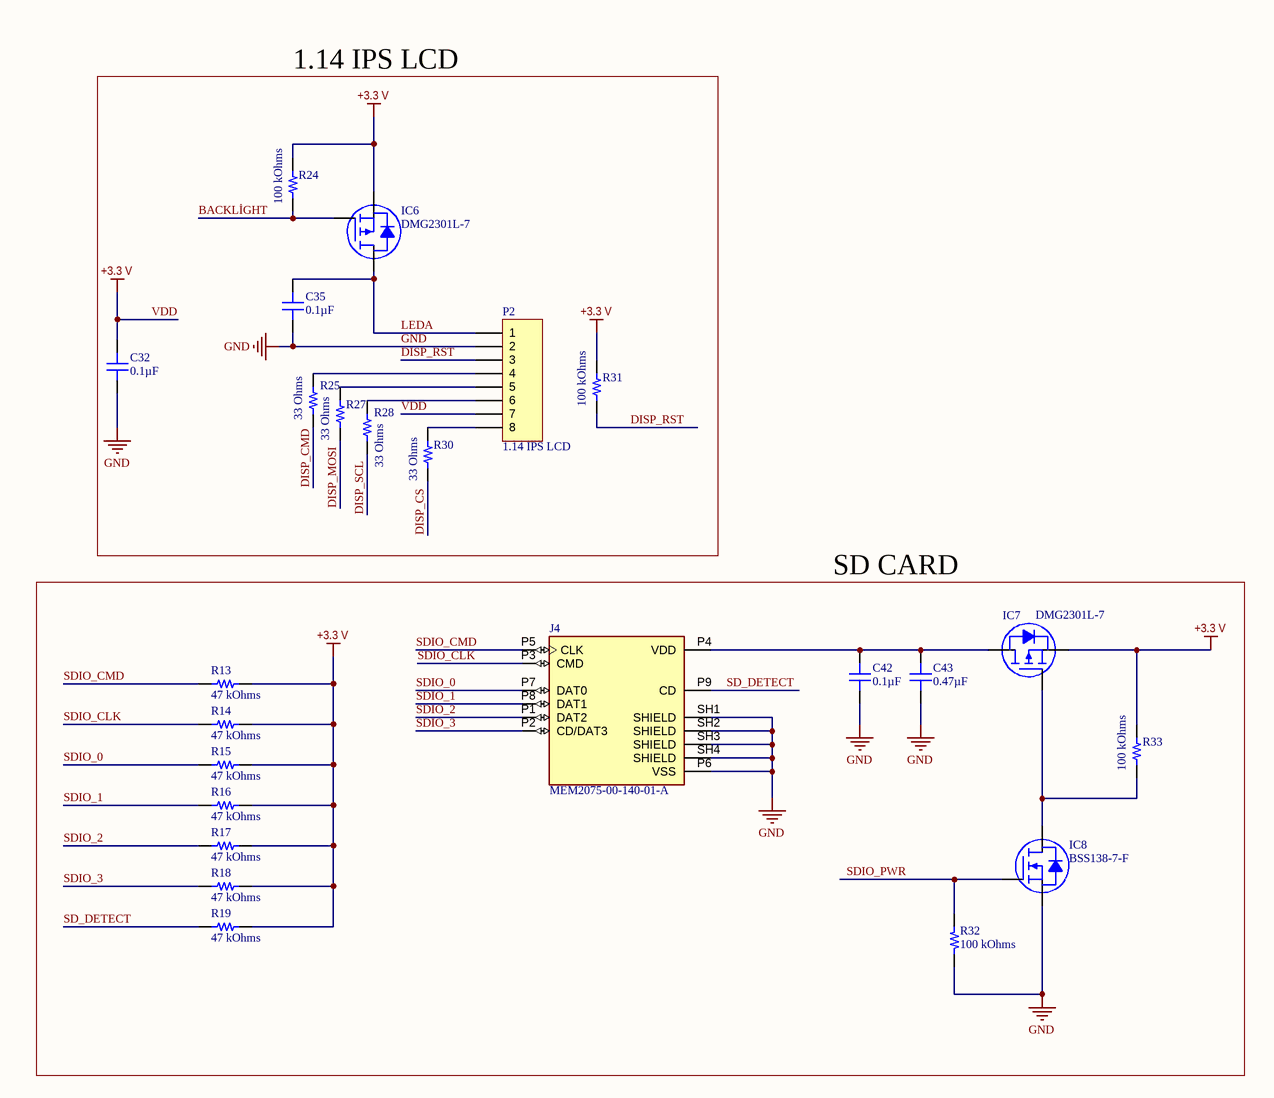
[diagram p4: Sheet2.SchDoc, bottom left]
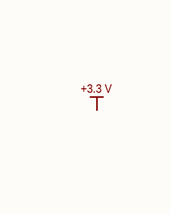
[diagram p5: Sheet2.SchDoc, bottom right]

### Parts
C32  0.1µF  [CAP 0603_1608]
C33  20 pF  [CAP 0603_1608]
C34  20 pF  [CAP 0603_1608]
C35  0.1µF  [CAP 0603_1608]
C36  20 pF  [CAP 0603_1608]
C37  20 pF  [CAP 0603_1608]
C38  0.1µF  [CAP 0603_1608]
C39  0.1µF  [CAP 0603_1608]
C40  0.1µF  [CAP 0603_1608]
C41  0.1µF  [CAP 0603_1608]
C42  0.1µF  [CAP 0603_1608]
C43  0.47µF  [CAP 0603_1608]
C44  0.1µF  [CAP 0603_1608]
C45  20 pF  [CAP 0603_1608]
C46  20 pF  [CAP 0603_1608]
C47  0.1µF  [CAP 0603_1608]
C48  0.1µF  [CAP 0603_1608]
FB1  100 Ohms @ 100 MHz  [FER 0603_1608]
FB2  100 Ohms @ 100 MHz  [FER 0603_1608]
FB3  100 Ohms @ 100 MHz  [FER 0603_1608]
FB4  100 Ohms @ 100 MHz  [FER 0603_1608]
IC6  DMG2301L-7  [DIODES SOT-23-3]
IC7  DMG2301L-7  [DIODES SOT-23-3]
IC8  BSS138-7-F  [DIODES SOT-23-3]
J4  MEM2075-00-140-01-A  [GCT_MEM2075-00-140-01-A]
P2  1.14 IPS LCD  [HIROSE_FH52-8S-0.5SH(99)]
R13  47 kOhms  [RES 0603_1608]
R14  47 kOhms  [RES 0603_1608]
R15  47 kOhms  [RES 0603_1608]
R16  47 kOhms  [RES 0603_1608]
R17  47 kOhms  [RES 0603_1608]
R18  47 kOhms  [RES 0603_1608]
R19  47 kOhms  [RES 0603_1608]
R20  33 Ohms  [RES 0603_1608]
R21  33 Ohms  [RES 0603_1608]
R22  33 Ohms  [RES 0603_1608]
R23  33 Ohms  [RES 0603_1608]
R24  100 kOhms  [RES 0603_1608]
R25  33 Ohms  [RES 0603_1608]
R26  0 Ohms  [RES 0603_1608]
R27  33 Ohms  [RES 0603_1608]
R28  33 Ohms  [RES 0603_1608]
R29  0 Ohms  [RES 0603_1608]
R30  33 Ohms  [RES 0603_1608]
R31  100 kOhms  [RES 0603_1608]
R32  100 kOhms  [RES 0603_1608]
R33  100 kOhms  [RES 0603_1608]
R34  33 Ohms  [RES 0603_1608]
R35  33 Ohms  [RES 0603_1608]
R36  0 Ohms  [RES 0603_1608]
R37  0 Ohms  [RES 0603_1608]
U2  ICM-20948  [QFN40P300X300X105-24N]
U3  KX126-1063  [KIONIX_KXTJ3-1057]
U4  BME280  [PSON65P250X250X100-8N]

### Blocks framed on the sheet
ACCELEROMETER: C36-C39 FB1 R22 R23 U3
PRESSURE: C45-C48 FB4 R34-R37 U4
GYROSCOP: C33 C34 C40 C41 C44 FB2 FB3 R20 R21 R26 R29 U2
1.14 IPS LCD: C32 C35 IC6 P2 R24 R25 R27 R28 R30 R31
SD CARD: C42 C43 IC7 IC8 J4 R13-R19 R32 R33

### Nets
1.8V: FB2.2 R29.2
GND: C32.1 C33.1 C34.2 C35.1 C36.1 C37.2 C38.2 C39.1 C40.1 C41.1 C42.1 C43.1 C44.1 C45.1 C46.2 C47.1 C48.1 IC8.2(S) J4.P6(VSS) J4.SH1(SHIELD) J4.SH2(SHIELD) J4.SH3(SHIELD) J4.SH4(SHIELD) P2.2 R26.1 R32.1 R37.1 U2.11(FSYNC) U2.18(GND) U2.20(RESV_20) U3.4(TRIG) U3.8(GND) U3.9(GND) U3.11(NC) U4.1(GND) U4.7(GND)
VDD: C32.2 FB1.2 FB3.2 FB4.2 IC6.2(S) IC7.2(S) P2.7 R13.2 R14.2 R15.2 R16.2 R17.2 R18.2 R19.2 R24.2 R31.2 R33.2 R36.2 U3.1(SDO/ADDR) U3.10(nCS) U4.2(CSB)  [also labelled +3.3 V]
ACCEL_INT1: U3.5(INT1)
ACCEL_INT2: U3.6(INT2)
BACKLİGHT: IC6.1(G) R24.1
BME_ADDRES: R36.1 R37.2 U4.5(SDO)
~{CS}: C41.2 FB2.1 U2.8(VDDIO) U2.22(~{CS})
DISP_CMD: R25.2
DISP_CS: R30.1
DISP_MOSI: R27.1
DISP_RST: P2.3 R31.1
DISP_SCL: R28.1
GRYO_I2C_SCL: R20.1
GRYO_I2C_SDA: R21.1
GYRO_INT: U2.12(INT1)
I2C_SCK: R34.2
I2C_SCL: R23.1
I2C_SDA: R22.1 R35.1
LEDA: C35.2 IC6.3(D) P2.1
SD_DETECT: J4.P9(CD) R19.1
SDIO_0: J4.P7(DAT0) R15.1
SDIO_1: J4.P8(DAT1) R16.1
SDIO_2: J4.P1(DAT2) R17.1
SDIO_3: J4.P2(CD/DAT3) R18.1
SDIO_CLK: J4.P3(CMD) R14.1
SDIO_CMD: J4.P5(CLK) R13.1
SDIO_PWR: IC8.1(G) R32.2
NetC33_2: C33.2 R20.2 U2.23(SCL/SCLK)
NetC34_1: C34.1 R21.2 U2.24(SDA/SDI)
NetC36_2: C36.2 R22.2 U3.2(SDI/SDA)
NetC37_1: C37.1 R23.2 U3.12(SCLK/SCL)
NetC38_1: C38.1 C39.2 FB1.1 U3.3(IO_VDD) U3.7(VDD)
NetC40_2: C40.2 U2.10(REGOUT)
NetC42_2: C42.2 C43.2 IC7.3(D) J4.P4(VDD)
NetC44_2: C44.2 FB3.1 U2.13(VDD)
NetC45_2: C45.2 R34.1 U4.4(SCK)
NetC46_1: C46.1 R35.2 U4.3(SDI)
NetC47_2: C47.2 C48.2 FB4.1 U4.6(VDDIO) U4.8(VDD)
NetIC7_1: IC7.1(G) IC8.3(D) R33.1
NetP2_4: P2.4 R25.1
NetP2_5: P2.5 R27.2
NetP2_6: P2.6 R28.2
NetP2_8: P2.8 R30.2
NetR26_2: R26.2 R29.1 U2.9(AD0/SDO)

Not connected (* = marked no-connect by the designer): U2 1(NC) 2(NC) 3(NC) 4(NC) 5(NC) 6(NC) 7(AUX_CL) 14(NC) 15(NC) 16(NC) 17(NC) 19(RESV_19) 21(AUX_DA)

### Notes on the sheet
- Labels drawn without touching a wire or pin: +3.3 V
- DWG. NO.
- REV.
- SHT.
- REVISION
- DESCRIPTION
- DATE
- APPROVED
- THIS DOCUMENT AND THE DATA DISCLOSED HEREIN OR HEREWITH IS THE PROPERTY OF ALTIUM LIMITED AND MAY BE FREELY DISTRIBUTED IN WHOLE. NO RIGHTS ARE RESERVED OR EXPRESS OR IMPLIED WARANTEE GIVEN.
- ENG:
- DSN:
- APPROVALS
- PROJECT
- DOCUMENT REVISION:
- DESIGN ITEM:
- CHK:
- BOM:
- REFERENCE DOCUMENTS
- PROJECT REVISION:
- TITLE
- FAB DWG:
- PCB DWG:
- ASSY DWG:
- SCALE:
- SIZE
- C
- CAGE CODE
- FILE NAME
- DWG NO.
- SHEET
- OF
- REV

### Library data of the parts
C32 C35 C38-C42 C44 C47 C48 = 0603YD104KAT2A: as C1 on sheet Sheet1; Part Number: 0603YD104KAT2A; Value: 0.1µF; Applications: General Purpose; Capacitance: 0.1µF; componentlink1description: Datasheet; componentlink1url: http://datasheets.avx.com/cx5r.pdf; componentlink2description: DigiKey Link; componentlink2url: http://digikey.com/product-detail/en/avx-corporation/0603YD104KAT2A/478-0603YD104KAT2ACT-ND/11570385; Device Package: 0603 (1608 Metric); lastupdated: 2.09.2020 01:02:55; Lifecycle Status: Active; Minimum Order: 1; Mounting Type: Surface Mount, MLCC; Operating Temperature: -55°C ~ 85°C; Package / Case: 0603 (1608 Metric); packaging: TapeAndReel; partid: 27394; Part Status: Active; price: 0.05; series: -; Supplier 1: DigiKey; Supplier Part Number 1: 478-0603YD104KAT2ACT-ND; Temperature Coefficient: X5R; Voltage - Rated: 16V
C33 C34 C36 C37 C45 C46 = C0603C200C3GAC7867: CAP CER 20PF 25V NP0 0603; manufacturer: KEMET; Temperature Coefficient: C0G, NP0; Tolerance: ±0.25pF; Part Number: C0603C200C3GAC7867; Value: 20 pF; Applications: General Purpose; Capacitance: 20 pF; componentlink1description: Datasheet; componentlink1url: https://api.kemet.com/component-edge/download/datasheet/C0603C200C3GACTU.pdf; componentlink2description: DigiKey Link; componentlink2url: https://www.digikey.com/en/products/detail/kemet/C0603C200C3GAC7867/2200134; Device Package: 0603 (1608 Metric); Features: Low ESL; lastupdated: 14.08.2022 21:09:36; Lifecycle Status: Active; Minimum Order: 1; Mounting Type: Surface Mount, MLCC; Operating Temperature: -55°C ~ 125°C; Package / Case: 0603 (1608 Metric); packaging: TapeAndReel; partid: 6454; Part Status: Active; price: 0.30; series: SMD Comm C0G; Size / Dimension: 0.063" L x 0.031" W (1.60mm x 0.80mm); Supplier 1: DigiKey; Supplier Part Number 1: 399-14496-1-ND; Thickness (Max): 0.034" (0.87mm); Voltage - Rated: 25V
C43 = 0603ZD474KAT2A: as C4 on sheet Sheet1; Part Number: 0603ZD474KAT2A; Value: 0.47µF; Applications: General Purpose; Capacitance: 0.47µF; componentlink1description: Datasheet; componentlink1url: http://datasheets.avx.com/cx5r.pdf; componentlink2description: DigiKey Link; componentlink2url: http://digikey.com/product-detail/en/avx-corporation/0603ZD474KAT2A/478-7942-1-ND/3881565; Device Package: 0603 (1608 Metric); lastupdated: 2.09.2020 01:03:34; Lifecycle Status: Active; Minimum Order: 1; Mounting Type: Surface Mount, MLCC; Operating Temperature: -55°C ~ 85°C; Package / Case: 0603 (1608 Metric); packaging: TapeAndReel; partid: 3385; Part Status: Active; price: 0.10; series: -; Size / Dimension: 0.063" L x 0.032" W (1.60mm x 0.81mm); Supplier 1: DigiKey; Supplier Part Number 1: 478-7942-1-ND; Temperature Coefficient: X5R; Thickness (Max): 0.035" (0.90mm); Voltage - Rated: 10V
FB1-FB4 = MH1608-101Y: FERRITE BEAD 100 OHM 0603 1LN; Manufacturer: Bourns Inc.; Current Rating (Max): 3A; DC Resistance (DCR) (Max): 40mOhm; Filter Type: Power, Signal Line; Number of Lines: 1; Part Number: MH1608-101Y; ComponentLink1Description: Datasheet; ComponentLink1URL: https://www.bourns.com/docs/Product-Datasheets/mh.pdf; ComponentLink2Description: DigiKey Link; ComponentLink2URL: https://www.digikey.com/en/products/detail/bourns-inc/MH1608-101Y/2563310; Device Package: 0603 (1608 Metric); Height (Max): 0.039" (1.00mm); Impedance @ Frequency: 100 Ohms @ 100 MHz; LastUpdated: 14.08.2022 21:51:57; Lifecycle Status: Active; Minimum Order: 1; Mounting Type: Surface Mount; Operating Temperature: -55°C ~ 125°C; Package / Case: 0603 (1608 Metric); Packaging: TapeAndReel; PartId: 645; Part Status: Active; Price: 0.02; Series: MH; Size / Dimension: 0.063" L x 0.032" W (1.60mm x 0.80mm); Supplier 1: DigiKey; Supplier Part Number 1: MH1608-101YCT-ND; Value: 100 Ohms @ 100 MHz
IC6 IC7 = DMG2301L-7: MOSFET P-CH 20V 3A SOT23; Part Number: DMG2301L-7
IC8 = BSS138-7-F: MOSFET N-CH 50V 200MA SOT23-3; Part Number: BSS138-7-F
J4 = MEM2075-00-140-01-A: Micro SD Memory Card Connector, 1.4mm Profile SMT, Push-Push, with Normally open Switch; Value: *; MP: MEM2075-00-140-01-A; Package: None; Availability: Unavailable; Price: None
P2 = Header 8: Header, 8-Pin; LatestRevisionDate: 17-Jul-2002; LatestRevisionNote: Re-released for DXP Platform.; Publisher: Altium Limited
R13-R19 = CRGCQ0603J47K: RES 47K OHM 5% 1/10W 0603; Manufacturer: TE Connectivity Passive Product; Power (Watts): 0.1W, 1/10W; Temperature Coefficient: ±100ppm/°C; Part Number: CRGCQ0603J47K; Value: 47 kOhms; ComponentLink1Description: Datasheet; ComponentLink1URL: https://www.te.com/commerce/DocumentDelivery/DDEController?Action=srchrtrv&DocNm=1773204-3&DocType=DS&DocLang=English; ComponentLink2Description: DigiKey Link; ComponentLink2URL: https://www.digikey.com/en/products/detail/te-connectivity-passive-product/CRGCQ0603J47K/8576703; Composition: Thick Film; Device Package: 0603 (1608 Metric); Features: Automotive AEC-Q200, Moisture Resistant; Height - Seated (Max): 0.022" (0.55mm); LastUpdated: 14.08.2022 21:30:17; Lifecycle Status: Active; Minimum Order: 1; Number of Terminations: 2; Operating Temperature: -55°C ~ 155°C; Package / Case: 0603 (1608 Metric); Packaging: CutTape; PartId: 25686; Part Status: Active; Price: 0.01; Ratings: AEC-Q200; Resistance: 47 kOhms; Series: CRGCQ; Size / Dimension: 0.063" L x 0.031" W (1.60mm x 0.80mm); Supplier 1: DigiKey; Supplier Part Number 1: A130101CT-ND; Supplier Device Package: 0603; Tolerance: ±5%
R20-R23 R25 R27 R28 R30 R34 R35 = AC0603JR-0733RL: as R11 on sheet Sheet1; Part Number: AC0603JR-0733RL; Value: 33 Ohms; ComponentLink1Description: Datasheet; ComponentLink1URL: https://www.yageo.com/upload/media/product/productsearch/datasheet/rchip/PYu-AC_51_RoHS_L_7.pdf; ComponentLink2Description: DigiKey Link; ComponentLink2URL: https://www.digikey.com/en/products/detail/yageo/AC0603JR-0733RL/5896437; Composition: Thick Film; Device Package: 0603 (1608 Metric); Features: Automotive AEC-Q200, Moisture Resistant; Height - Seated (Max): 0.022" (0.55mm); LastUpdated: 14.08.2022 21:30:39; Lifecycle Status: Active; Minimum Order: 1; Number of Terminations: 2; Operating Temperature: -55°C ~ 155°C; Package / Case: 0603 (1608 Metric); Packaging: CutTape; PartId: 22917; Part Status: Active; Price: 0.01; Ratings: AEC-Q200; Resistance: 33 Ohms; Series: AC; Size / Dimension: 0.063" L x 0.031" W (1.60mm x 0.80mm); Supplier 1: DigiKey; Supplier Part Number 1: YAG3666CT-ND; Supplier Device Package: 0603; Tolerance: ±5%
R24 R31-R33 = CRCW0603100KJNEA: as R1 on sheet Sheet1; Part Number: CRCW0603100KJNEA; Value: 100 kOhms; ComponentLink1Description: Datasheet; ComponentLink1URL: http://www.vishay.com/docs/20035/dcrcwe3.pdf; ComponentLink2Description: DigiKey Link; ComponentLink2URL: https://www.digikey.com/en/products/detail/vishay-dale/CRCW0603100KJNEA/1174277; Composition: Thick Film; Device Package: 0603 (1608 Metric); Features: Automotive AEC-Q200; Height - Seated (Max): 0.020" (0.50mm); LastUpdated: 14.08.2022 21:30:46; Lifecycle Status: Active; Minimum Order: 1; Number of Terminations: 2; Operating Temperature: -55°C ~ 155°C; Package / Case: 0603 (1608 Metric); Packaging: CutTape; PartId: 21189; Part Status: Active; Price: 0.01; Ratings: AEC-Q200; Resistance: 100 kOhms; Series: CRCW; Size / Dimension: 0.063" L x 0.033" W (1.60mm x 0.85mm); Supplier 1: DigiKey; Supplier Part Number 1: 541-100KGCT-ND; Supplier Device Package: 0603; Tolerance: ±5%
R26 R29 R36 R37 = 5111: RES 0 OHM JUMPER 0603; Part Number: 5111; Manufacturer: Keystone Electronics; Power (Watts): 0.5W, 1/2W; Value: 0 Ohms; ComponentLink1Description: Datasheet; ComponentLink1URL: http://www.keyelco.com/product-pdf.cfm?p=14349; ComponentLink2Description: DigiKey Link; ComponentLink2URL: https://www.digikey.com/en/products/detail/keystone-electronics/5111/7942980; Composition: Metal Element; Device Package: 0603 (1608 Metric); Height - Seated (Max): 0.033" (0.84mm); LastUpdated: 14.08.2022 21:30:44; Lifecycle Status: Active; Minimum Order: 1; Number of Terminations: 2; Package / Case: 0603 (1608 Metric); Packaging: TapeAndReel; PartId: 21630; Part Status: Active; Price: 0.16; Resistance: 0 Ohms; Series: -; Size / Dimension: 0.061" L x 0.033" W (1.55mm x 0.85mm); Supplier 1: DigiKey; Supplier Part Number 1: 36-5111CT-ND; Supplier Device Package: 0603; Tolerance: Jumper
U2 = ICM-20948: Accelerometer, Gyroscope, Magnetometer, 9 Axis Sensor IÂ²C, SPI Output; Value: *; Availability: Unavailable; Price: None; Package: None; MP: ICM-20948
U4 = BME280: DIGITAL HUMIDITY, PRESSURE AND TEMPERATURE SENSOR<br>* Digital interface IÂ²C (up to 3.4 MHz) and SPI (3 and 4 wire, up to 10 MHz)* Supply voltage VDD main supply voltage range: 1.71 V to 3.6 V*VDDIO interface voltage range: 1.2 V to 3.6 V<br> Operating range -40â€¦+85 Â°C, 0â€¦100 % rel. humidity, 300â€¦1100 hPa <br><br>  The library has been designed by<a href="https://www.facebook.com/groups/eaglecadsoftUK"> Richard Magdycz</a>; Price: None; MP: BME280; Value: *; Availability: Unavailable; Package: None

## Nets that join several sheets
1.8V: Sheet1 (6 pins), Sheet2 (FB2.2 R29.2)
GND: Sheet1 (72 pins), Sheet2 (36 pins)
VDD: Sheet1 (39 pins), Sheet2 (21 pins)
ACCEL_INT1: Sheet1 (U5.65), Sheet2 (U3.5)
ACCEL_INT2: Sheet1 (U5.91), Sheet2 (U3.6)
DISP_CMD: Sheet1 (U5.79), Sheet2 (R25.2)
DISP_CS: Sheet1 (U5.74), Sheet2 (R30.1)
DISP_MOSI: Sheet1 (U5.60), Sheet2 (R27.1)
DISP_RST: Sheet1 (U5.70), Sheet2 (P2.3 R31.1)
DISP_SCL: Sheet1 (U5.61), Sheet2 (R28.1)
GRYO_I2C_SCL: Sheet1 (U1.2), Sheet2 (R20.1)
GRYO_I2C_SDA: Sheet1 (U1.3), Sheet2 (R21.1)
GYRO_INT: Sheet1 (U5.66), Sheet2 (U2.12)
I2C_SCK: Sheet1 (U1.6 U5.7), Sheet2 (R34.2)
I2C_SCL: Sheet1 (U5.54), Sheet2 (R23.1)
I2C_SDA: Sheet1 (U1.7 U5.81), Sheet2 (R22.1 R35.1)
SD_DETECT: Sheet1 (U5.2), Sheet2 (J4.P9 R19.1)
SDIO_0: Sheet1 (U5.1), Sheet2 (J4.P7 R15.1)
SDIO_1: Sheet1 (U5.31), Sheet2 (J4.P8 R16.1)
SDIO_2: Sheet1 (U5.5), Sheet2 (J4.P1 R17.1)
SDIO_3: Sheet1 (U5.9), Sheet2 (J4.P2 R18.1)
SDIO_CLK: Sheet1 (U5.24), Sheet2 (J4.P3 R14.1)
SDIO_CMD: Sheet1 (U5.87), Sheet2 (J4.P5 R13.1)
SDIO_PWR: Sheet1 (U5.55), Sheet2 (IC8.1 R32.2)